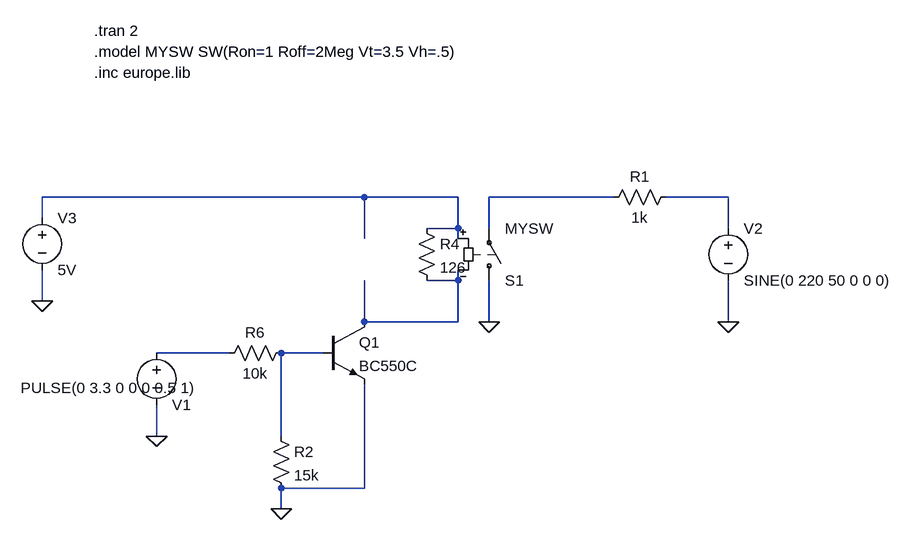
[diagram p0: schematic Relais_Plug_Switch.asc]
Relais_Plug_Switch.asc, the LTspice schematic file:
Version 4
SHEET 1 880 680
WIRE 0 96 -496 96
WIRE 144 96 0 96
WIRE 384 96 192 96
WIRE 560 96 464 96
WIRE -496 128 -496 96
WIRE 144 144 144 96
WIRE 144 144 96 144
WIRE 192 144 192 96
WIRE 560 144 560 96
WIRE 0 160 0 96
WIRE 144 160 144 144
WIRE 144 224 144 208
WIRE 144 224 96 224
WIRE -496 256 -496 208
WIRE 0 288 0 224
WIRE 144 288 144 224
WIRE 144 288 0 288
WIRE 192 288 192 224
WIRE 560 288 560 224
WIRE -208 336 -320 336
WIRE -64 336 -128 336
WIRE -320 464 -320 416
WIRE -128 464 -128 336
WIRE 0 544 0 384
WIRE 0 544 -128 544
WIRE -128 576 -128 544
FLAG -320 464 0
FLAG 192 288 0
FLAG 560 288 0
FLAG -496 256 0
FLAG -128 576 0
SYMBOL voltage -320 320 R0
WINDOW 0 24 96 Left 2
WINDOW 3 -209 70 Left 2
WINDOW 123 0 0 Left 2
WINDOW 39 0 0 Left 2
SYMATTR InstName V1
SYMATTR Value PULSE(0 3.3 0 0 0 0.5 1)
SYMBOL sw 192 240 M180
SYMATTR InstName S1
SYMATTR Value MYSW
SYMBOL voltage 560 128 R0
WINDOW 123 24 124 Left 2
WINDOW 39 0 0 Left 2
SYMATTR InstName V2
SYMATTR Value SINE(0 220 50 0 0 0)
SYMBOL res 480 80 R90
WINDOW 0 0 56 VBottom 2
WINDOW 3 32 56 VTop 2
SYMATTR InstName R1
SYMATTR Value 1k
SYMBOL voltage -496 112 R0
SYMATTR InstName V3
SYMATTR Value 5V
SYMBOL npn -64 288 R0
SYMATTR InstName Q1
SYMATTR Value BC550C
SYMBOL res 80 128 R0
SYMATTR InstName R4
SYMATTR Value 126
SYMBOL res -112 320 R90
WINDOW 0 0 56 VBottom 2
WINDOW 3 32 56 VTop 2
SYMATTR InstName R6
SYMATTR Value 10k
SYMBOL res -144 448 R0
SYMATTR InstName R2
SYMATTR Value 15k
TEXT -416 -160 Left 2 !.tran 2
TEXT -416 -128 Left 2 !.model MYSW SW(Ron=1 Roff=2Meg Vt=3.5 Vh=.5)
TEXT -416 -96 Left 2 !.inc europe.lib

The netlist it stands for:
* Relais_Plug_Switch.asc
V1 N005 0 PULSE(0 3.3 0 0 0 0.5 1)
S1 0 N002 N001 N004 MYSW
V2 N003 0 SINE(0 220 50 0 0 0)
R1 N003 N002 1k
V3 N001 0 5V
Q1 N004 N006 0 0 BC550C
R4 N001 N004 126
R6 N006 N005 10k
R2 N006 0 15k
.model NPN NPN
.model PNP PNP
.lib standard.bjt
.tran 2
.model MYSW SW(Ron=1 Roff=2Meg Vt=3.5 Vh=.5)
.inc europe.lib
.backanno
.end